# Altium schematic sheet nuc977.SchDoc
size A3
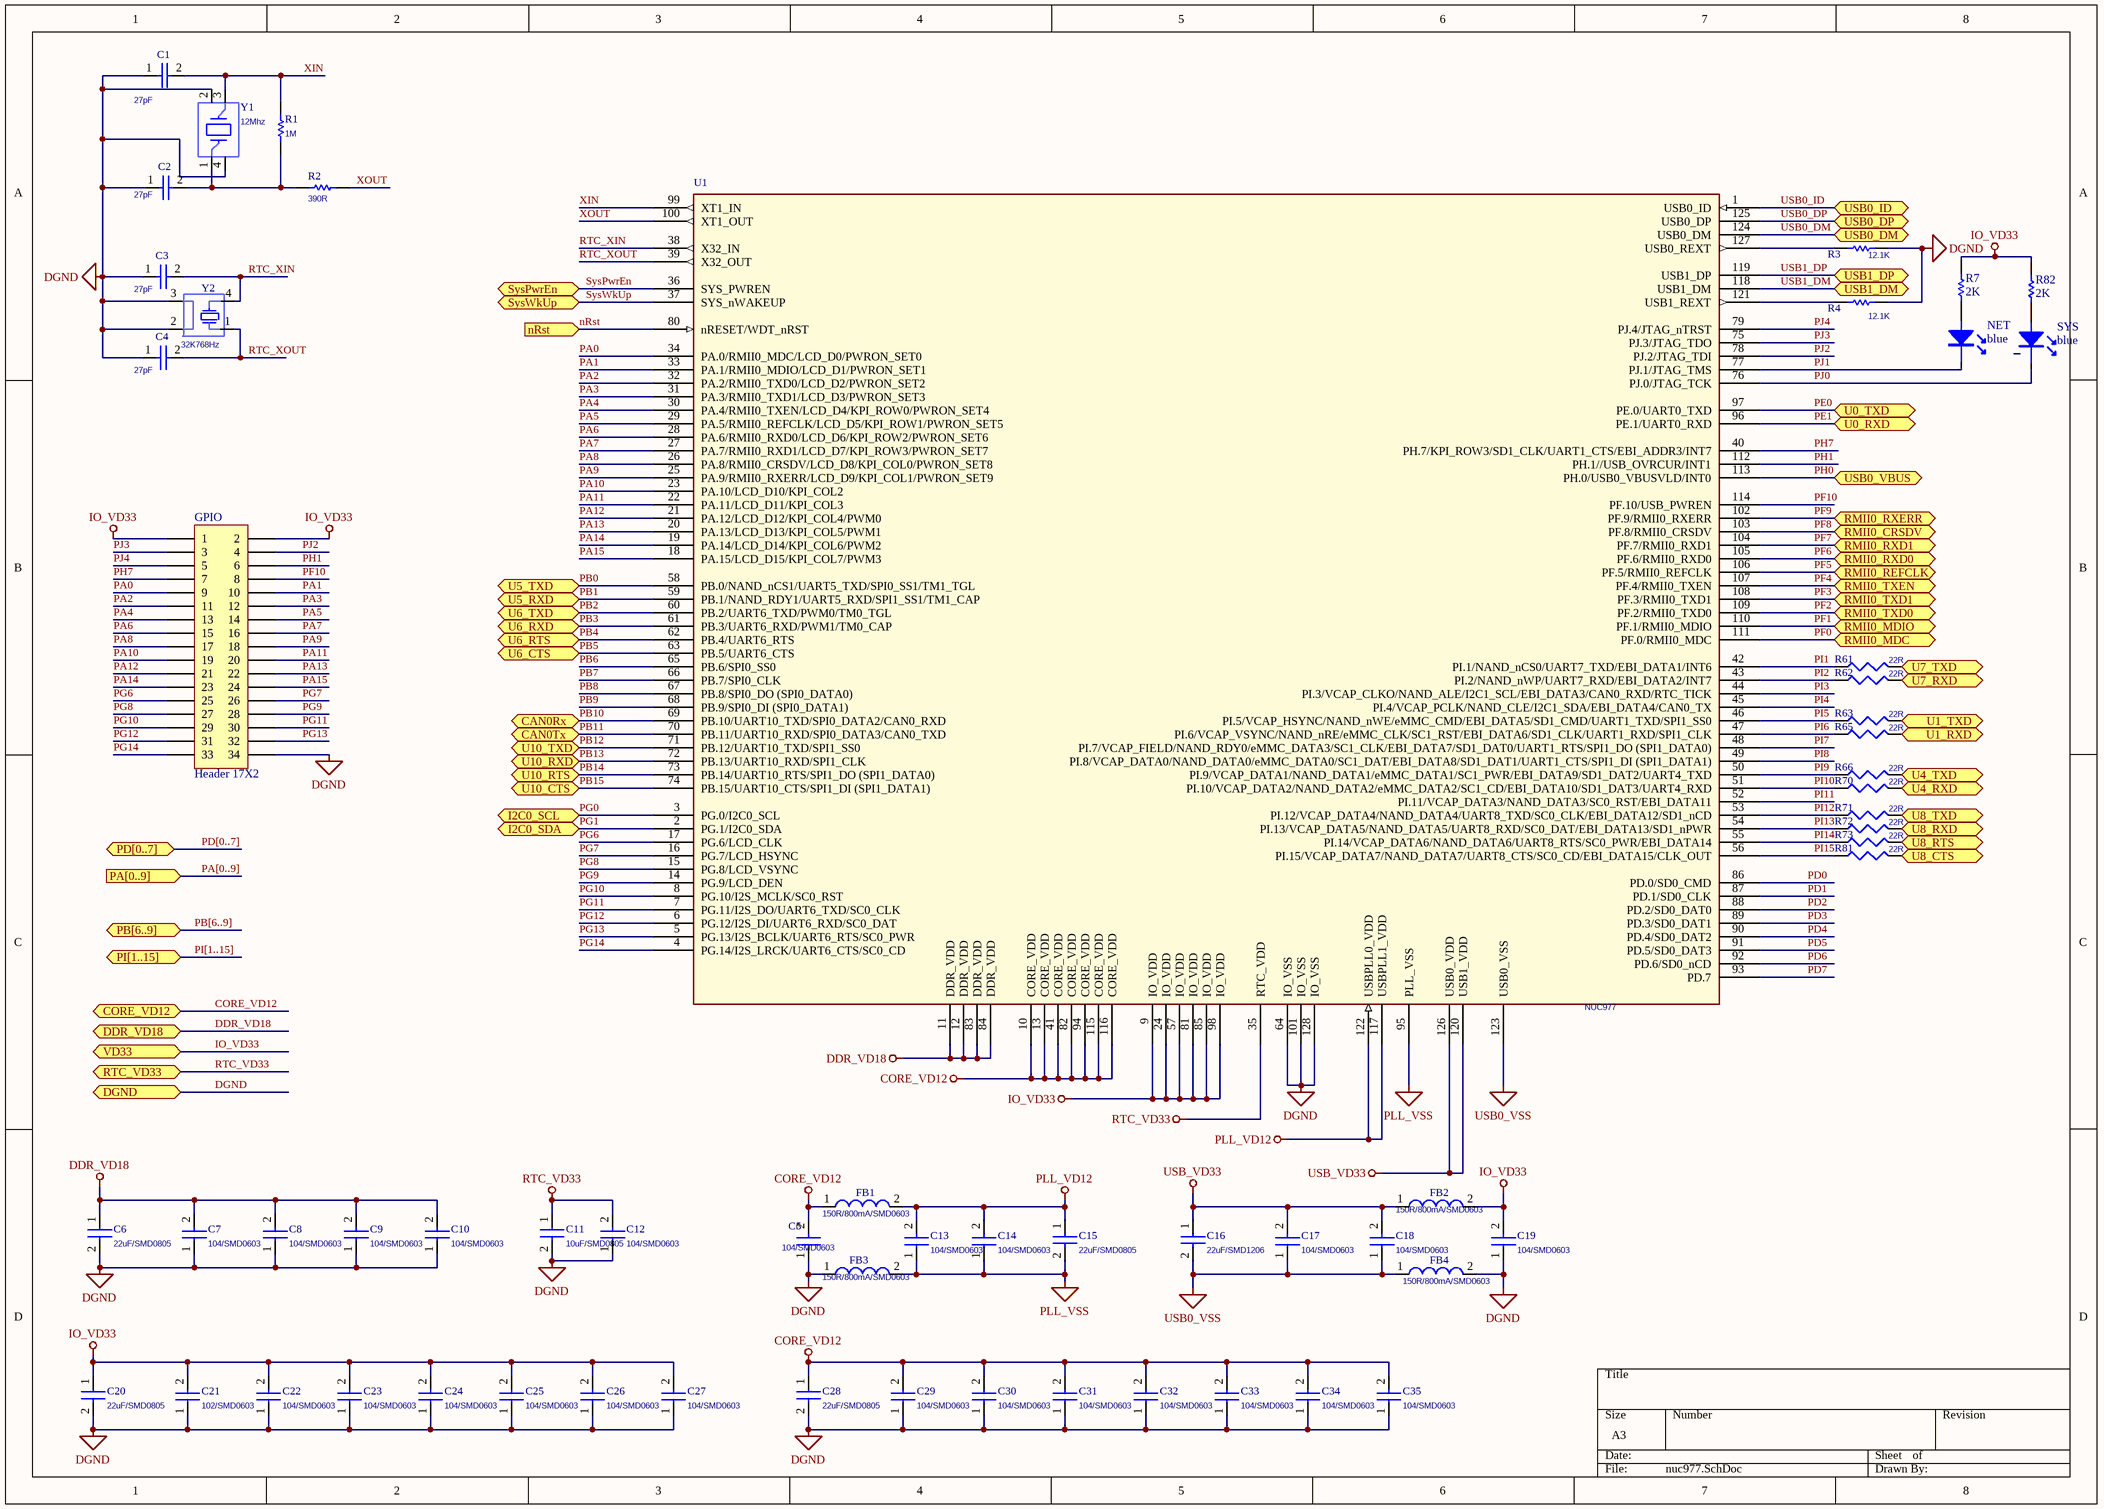
[diagram p0: nuc977.SchDoc]

## Parts
C1  27pF  [0603C]
C2  27pF  [0603C]
C3  27pF  [0603C]
C4  27pF  [0603C]
C5  104/SMD0603  [0603C]
C6  22uF/SMD0805  [C0805]
C7  104/SMD0603  [0603C]
C8  104/SMD0603  [0603C]
C9  104/SMD0603  [0603C]
C10  104/SMD0603  [0603C]
C11  10uF/SMD0805  [C0805]
C12  104/SMD0603  [0603C]
C13  104/SMD0603  [0603C]
C14  104/SMD0603  [0603C]
C15  22uF/SMD0805  [C0805]
C16  22uF/SMD1206  [C0805]
C17  104/SMD0603  [0603C]
C18  104/SMD0603  [0603C]
C19  104/SMD0603  [0603C]
C20  22uF/SMD0805  [C0805]
C21  102/SMD0603  [0603C]
C22  104/SMD0603  [0603C]
C23  104/SMD0603  [0603C]
C24  104/SMD0603  [0603C]
C25  104/SMD0603  [0603C]
C26  104/SMD0603  [0603C]
C27  104/SMD0603  [0603C]
C28  22uF/SMD0805  [C0805]
C29  104/SMD0603  [0603C]
C30  104/SMD0603  [0603C]
C31  104/SMD0603  [0603C]
C32  104/SMD0603  [0603C]
C33  104/SMD0603  [0603C]
C34  104/SMD0603  [0603C]
C35  104/SMD0603  [0603C]
FB1  150R/800mA/SMD0603  [0603R]
FB2  150R/800mA/SMD0603  [0603R]
FB3  150R/800mA/SMD0603  [0603R]
FB4  150R/800mA/SMD0603  [0603R]
GPIO  Header 17X2  [HDR2X17]
NET  blue  [LED-0603]
R1  1M  [0603R]
R2  390R  [0603R]
R3  12.1K  [0603R]
R4  12.1K  [0603R]
R7  2K  [0603C]
R61  22R  [0603R]
R62  22R  [0603R]
R63  22R  [0603R]
R65  22R  [0603R]
R66  22R  [0603R]
R70  22R  [0603R]
R71  22R  [0603R]
R72  22R  [0603R]
R73  22R  [0603R]
R81  22R  [0603R]
R82  2K  [0603C]
SYS  blue  [LED-0603]
U1  NUC977  [QFP128/16/0.4]
Y1  12Mhz  [HCX-3SB3225]
Y2  32K768Hz  [32K768Hz]

## Ports
CAN0Rx, CAN0Tx, CORE_VD12, DDR_VD18, DGND, I2C0_SCL, I2C0_SDA, nRst (in), PA[0..9] (in), PB[6..9], PD[0..7], PI[1..15], RMII0_CRSDV, RMII0_MDC, RMII0_MDIO, RMII0_REFCLK, RMII0_RXD0, RMII0_RXD1, RMII0_RXERR, RMII0_TXD0, RMII0_TXD1, RMII0_TXEN, RTC_VD33, SysPwrEn (bidir), SysWkUp (bidir), U0_RXD, U0_TXD, U1_RXD, U1_TXD, U4_RXD, U4_TXD, U5_RXD, U5_TXD, U6_CTS, U6_RTS, U6_RXD, U6_TXD, U7_RXD, U7_TXD, U8_CTS, U8_RTS, U8_RXD, U8_TXD, U10_CTS, U10_RTS, U10_RXD, U10_TXD, USB0_DM, USB0_DP, USB0_ID, USB0_VBUS, USB1_DM, USB1_DP, VD33

## Nets
CORE_VD12: C5.2 C28.1 C29.2 C30.2 C31.2 C32.2 C33.2 C34.2 C35.2 FB1.1 U1.10(CORE_VDD) U1.13(CORE_VDD) U1.41(CORE_VDD) U1.82(CORE_VDD) U1.94(CORE_VDD) U1.115(CORE_VDD) U1.116(CORE_VDD) ; port CORE_VD12
DDR_VD18: C6.1 C7.2 C8.2 C9.2 C10.2 U1.11(DDR_VDD) U1.12(DDR_VDD) U1.83(DDR_VDD) U1.84(DDR_VDD) ; port DDR_VD18
DGND: C1.1 C2.1 C3.1 C4.1 C5.1 C6.2 C7.1 C8.1 C9.1 C10.1 C11.2 C12.1 C19.1 C20.2 C21.1 C22.1 C23.1 C24.1 C25.1 C26.1 C27.1 C28.2 C29.1 C30.1 C31.1 C32.1 C33.1 C34.1 C35.1 FB3.1 FB4.2 GPIO.34 R3.2 R4.2 U1.64(IO_VSS) U1.101(IO_VSS) U1.128(IO_VSS) Y1.2 Y1.4 Y2.2 Y2.3 ; port DGND
IO_VD33: C19.2 C20.1 C21.2 C22.2 C23.2 C24.2 C25.2 C26.2 C27.2 FB2.2 GPIO.1 GPIO.2 R7.2 R82.2 U1.9(IO_VDD) U1.24(IO_VDD) U1.57(IO_VDD) U1.81(IO_VDD) U1.85(IO_VDD) U1.98(IO_VDD) ; port VD33
PLL_VD12: C13.2 C14.2 C15.1 FB1.2 U1.117(USBPLL1_VDD) U1.122(USBPLL0_VDD)
PLL_VSS: C13.1 C14.1 C15.2 FB3.2 U1.95(PLL_VSS)
RTC_VD33: C11.1 C12.2 U1.35(RTC_VDD) ; port RTC_VD33
USB0_VSS: C16.2 C17.1 C18.1 FB4.1 U1.123(USB0_VSS)
USB_VD33: C16.1 C17.2 C18.2 FB2.1 U1.120(USB1_VDD) U1.126(USB0_VDD)
nRst: U1.80(nRESET/WDT_nRST) ; port nRst
PA0: GPIO.9 U1.34(PA.0/RMII0_MDC/LCD_D0/PWRON_SET0)
PA1: GPIO.10 U1.33(PA.1/RMII0_MDIO/LCD_D1/PWRON_SET1)
PA2: GPIO.11 U1.32(PA.2/RMII0_TXD0/LCD_D2/PWRON_SET2)
PA3: GPIO.12 U1.31(PA.3/RMII0_TXD1/LCD_D3/PWRON_SET3)
PA4: GPIO.13 U1.30(PA.4/RMII0_TXEN/LCD_D4/KPI_ROW0/PWRON_SET4)
PA5: GPIO.14 U1.29(PA.5/RMII0_REFCLK/LCD_D5/KPI_ROW1/PWRON_SET5)
PA6: GPIO.15 U1.28(PA.6/RMII0_RXD0/LCD_D6/KPI_ROW2/PWRON_SET6)
PA7: GPIO.16 U1.27(PA.7/RMII0_RXD1/LCD_D7/KPI_ROW3/PWRON_SET7)
PA8: GPIO.17 U1.26(PA.8/RMII0_CRSDV/LCD_D8/KPI_COL0/PWRON_SET8)
PA9: GPIO.18 U1.25(PA.9/RMII0_RXERR/LCD_D9/KPI_COL1/PWRON_SET9)
PA10: GPIO.19 U1.23(PA.10/LCD_D10/KPI_COL2)
PA11: GPIO.20 U1.22(PA.11/LCD_D11/KPI_COL3)
PA12: GPIO.21 U1.21(PA.12/LCD_D12/KPI_COL4/PWM0)
PA13: GPIO.22 U1.20(PA.13/LCD_D13/KPI_COL5/PWM1)
PA14: GPIO.23 U1.19(PA.14/LCD_D14/KPI_COL6/PWM2)
PA15: GPIO.24 U1.18(PA.15/LCD_D15/KPI_COL7/PWM3)
PB0: U1.58(PB.0/NAND_nCS1/UART5_TXD/SPI0_SS1/TM1_TGL) ; port U5_TXD
PB1: U1.59(PB.1/NAND_RDY1/UART5_RXD/SPI1_SS1/TM1_CAP) ; port U5_RXD
PB2: U1.60(PB.2/UART6_TXD/PWM0/TM0_TGL) ; port U6_TXD
PB3: U1.61(PB.3/UART6_RXD/PWM1/TM0_CAP) ; port U6_RXD
PB4: U1.62(PB.4/UART6_RTS) ; port U6_RTS
PB5: U1.63(PB.5/UART6_CTS) ; port U6_CTS
PB6: U1.65(PB.6/SPI0_SS0)
PB7: U1.66(PB.7/SPI0_CLK)
PB8: U1.67(PB.8/SPI0_DO_(SPI0_DATA0))
PB9: U1.68(PB.9/SPI0_DI_(SPI0_DATA1))
PB10: U1.69(PB.10/UART10_TXD/SPI0_DATA2/CAN0_RXD) ; port CAN0Rx
PB11: U1.70(PB.11/UART10_RXD/SPI0_DATA3/CAN0_TXD) ; port CAN0Tx
PB12: U1.71(PB.12/UART10_TXD/SPI1_SS0) ; port U10_TXD
PB13: U1.72(PB.13/UART10_RXD/SPI1_CLK) ; port U10_RXD
PB14: U1.73(PB.14/UART10_RTS/SPI1_DO_(SPI1_DATA0)) ; port U10_RTS
PB15: U1.74(PB.15/UART10_CTS/SPI1_DI_(SPI1_DATA1)) ; port U10_CTS
PD0: U1.86(PD.0/SD0_CMD)
PD1: U1.87(PD.1/SD0_CLK)
PD2: U1.88(PD.2/SD0_DAT0)
PD3: U1.89(PD.3/SD0_DAT1)
PD4: U1.90(PD.4/SD0_DAT2)
PD5: U1.91(PD.5/SD0_DAT3)
PD6: U1.92(PD.6/SD0_nCD)
PD7: U1.93(PD.7)
PE0: U1.97(PE.0/UART0_TXD) ; port U0_TXD
PE1: U1.96(PE.1/UART0_RXD) ; port U0_RXD
PF0: U1.111(PF.0/RMII0_MDC) ; port RMII0_MDC
PF1: U1.110(PF.1/RMII0_MDIO) ; port RMII0_MDIO
PF2: U1.109(PF.2/RMII0_TXD0) ; port RMII0_TXD0
PF3: U1.108(PF.3/RMII0_TXD1) ; port RMII0_TXD1
PF4: U1.107(PF.4/RMII0_TXEN) ; port RMII0_TXEN
PF5: U1.106(PF.5/RMII0_REFCLK) ; port RMII0_REFCLK
PF6: U1.105(PF.6/RMII0_RXD0) ; port RMII0_RXD0
PF7: U1.104(PF.7/RMII0_RXD1) ; port RMII0_RXD1
PF8: U1.103(PF.8/RMII0_CRSDV) ; port RMII0_CRSDV
PF9: U1.102(PF.9/RMII0_RXERR) ; port RMII0_RXERR
PF10: GPIO.8 U1.114(PF.10/USB_PWREN)
PG0: U1.3(PG.0/I2C0_SCL) ; port I2C0_SCL
PG1: U1.2(PG.1/I2C0_SDA) ; port I2C0_SDA
PG6: GPIO.25 U1.17(PG.6/LCD_CLK)
PG7: GPIO.26 U1.16(PG.7/LCD_HSYNC)
PG8: GPIO.27 U1.15(PG.8/LCD_VSYNC)
PG9: GPIO.28 U1.14(PG.9/LCD_DEN)
PG10: GPIO.29 U1.8(PG.10/I2S_MCLK/SC0_RST)
PG11: GPIO.30 U1.7(PG.11/I2S_DO/UART6_TXD/SC0_CLK)
PG12: GPIO.31 U1.6(PG.12/I2S_DI/UART6_RXD/SC0_DAT)
PG13: GPIO.32 U1.5(PG.13/I2S_BCLK/UART6_RTS/SC0_PWR)
PG14: GPIO.33 U1.4(PG.14/I2S_LRCK/UART6_CTS/SC0_CD)
PH0: U1.113(PH.0/USB0_VBUSVLD/INT0) ; port USB0_VBUS
PH1: GPIO.6 U1.112(PH.1//USB_OVRCUR/INT1)
PH7: GPIO.7 U1.40(PH.7/KPI_ROW3/SD1_CLK/UART1_CTS/EBI_ADDR3/INT7)
PI1: R61.1 U1.42(PI.1/NAND_nCS0/UART7_TXD/EBI_DATA1/INT6)
PI2: R62.1 U1.43(PI.2/NAND_nWP/UART7_RXD/EBI_DATA2/INT7)
PI3: U1.44(PI.3/VCAP_CLKO/NAND_ALE/I2C1_SCL/EBI_DATA3/CAN0_RXD/RTC_TICK)
PI4: U1.45(PI.4/VCAP_PCLK/NAND_CLE/I2C1_SDA/EBI_DATA4/CAN0_TX)
PI5: R63.1 U1.46(PI.5/VCAP_HSYNC/NAND_nWE/eMMC_CMD/EBI_DATA5/SD1_CMD/UART1_TXD/SPI1_SS0)
PI6: R65.1 U1.47(PI.6/VCAP_VSYNC/NAND_nRE/eMMC_CLK/SC1_RST/EBI_DATA6/SD1_CLK/UART1_RXD/SPI1_CLK)
PI7: U1.48(PI.7/VCAP_FIELD/NAND_RDY0/eMMC_DATA3/SC1_CLK/EBI_DATA7/SD1_DAT0/UART1_RTS/SPI1_DO_(SPI1_DATA0))
PI8: U1.49(PI.8/VCAP_DATA0/NAND_DATA0/eMMC_DATA0/SC1_DAT/EBI_DATA8/SD1_DAT1/UART1_CTS/SPI1_DI_(SPI1_DATA1))
PI9: R66.1 U1.50(PI.9/VCAP_DATA1/NAND_DATA1/eMMC_DATA1/SC1_PWR/EBI_DATA9/SD1_DAT2/UART4_TXD)
PI10: R70.1 U1.51(PI.10/VCAP_DATA2/NAND_DATA2/eMMC_DATA2/SC1_CD/EBI_DATA10/SD1_DAT3/UART4_RXD)
PI11: U1.52(PI.11/VCAP_DATA3/NAND_DATA3/SC0_RST/EBI_DATA11)
PI12: R71.1 U1.53(PI.12/VCAP_DATA4/NAND_DATA4/UART8_TXD/SC0_CLK/EBI_DATA12/SD1_nCD)
PI13: R72.1 U1.54(PI.13/VCAP_DATA5/NAND_DATA5/UART8_RXD/SC0_DAT/EBI_DATA13/SD1_nPWR)
PI14: R73.1 U1.55(PI.14/VCAP_DATA6/NAND_DATA6/UART8_RTS/SC0_PWR/EBI_DATA14)
PI15: R81.1 U1.56(PI.15/VCAP_DATA7/NAND_DATA7/UART8_CTS/SC0_CD/EBI_DATA15/CLK_OUT)
PJ0: SYS.2 U1.76(PJ.0/JTAG_TCK)
PJ1: NET.2 U1.77(PJ.1/JTAG_TMS)
PJ2: GPIO.4 U1.78(PJ.2/JTAG_TDI)
PJ3: GPIO.3 U1.75(PJ.3/JTAG_TDO)
PJ4: GPIO.5 U1.79(PJ.4/JTAG_nTRST)
RTC_XIN: C3.2 U1.38(X32_IN) Y2.4
RTC_XOUT: C4.2 U1.39(X32_OUT) Y2.1
SysPwrEn: U1.36(SYS_PWREN) ; port SysPwrEn
SysWkUp: U1.37(SYS_nWAKEUP) ; port SysWkUp
U1_RXD: R65.2 ; port U1_RXD
U1_TXD: R63.2 ; port U1_TXD
U4_RXD: R70.2 ; port U4_RXD
U4_TXD: R66.2 ; port U4_TXD
U7_RXD: R62.2 ; port U7_RXD
U7_TXD: R61.2 ; port U7_TXD
U8_CTS: R81.2 ; port U8_CTS
U8_RTS: R73.2 ; port U8_RTS
U8_RXD: R72.2 ; port U8_RXD
U8_TXD: R71.2 ; port U8_TXD
USB0_DM: U1.124(USB0_DM) ; port USB0_DM
USB0_DP: U1.125(USB0_DP) ; port USB0_DP
USB0_ID: U1.1(USB0_ID) ; port USB0_ID
USB1_DM: U1.118(USB1_DM) ; port USB1_DM
USB1_DP: U1.119(USB1_DP) ; port USB1_DP
XIN: C1.2 R1.1 U1.99(XT1_IN) Y1.3
XOUT: R2.2 U1.100(XT1_OUT)
NetC2_2: C2.2 R1.2 R2.1 Y1.1
NetNET_1: NET.1 R7.1
NetR3_1: R3.1 U1.127(USB0_REXT)
NetR4_1: R4.1 U1.121(USB1_REXT)
NetR82_1: R82.1 SYS.1

## Buses and harness runs
bus PA[0..9] = port PA[0..9]
bus PB[6..9] = port PB[6..9]
bus PD[0..7] = port PD[0..7]
bus PI[1..15] = port PI[1..15]

## Library data of the parts
C1-C4 = CAP: Capacitor
C5 C7-C10 C12-C14 C17-C19 C21-C27 C29-C35 = C/SMD0603
C6 C15 C16 C20 C28 = C/SMD1206
C11 = C/SMD0805
FB1-FB4 = FB/SMD0603
GPIO = Header 17X2: Header, 17-Pin, Dual row; LatestRevisionDate: 17-Jul-2002; LatestRevisionNote: Re-released for DXP Platform.; Publisher: Altium Limited
NET SYS = LED
R1-R4 R7 R82 = res1: Resistor; Value: 1K; Published: 8-Jun-2000; Revision: July-2002: Re-released for DXP Platform.; Publisher: Altium Limited
R61-R63 R65 R66 R70-R73 R81 = R_Dup1
U1 = NUC977_7